# Altium schematic sheet satFloat.SchDoc
size Legal
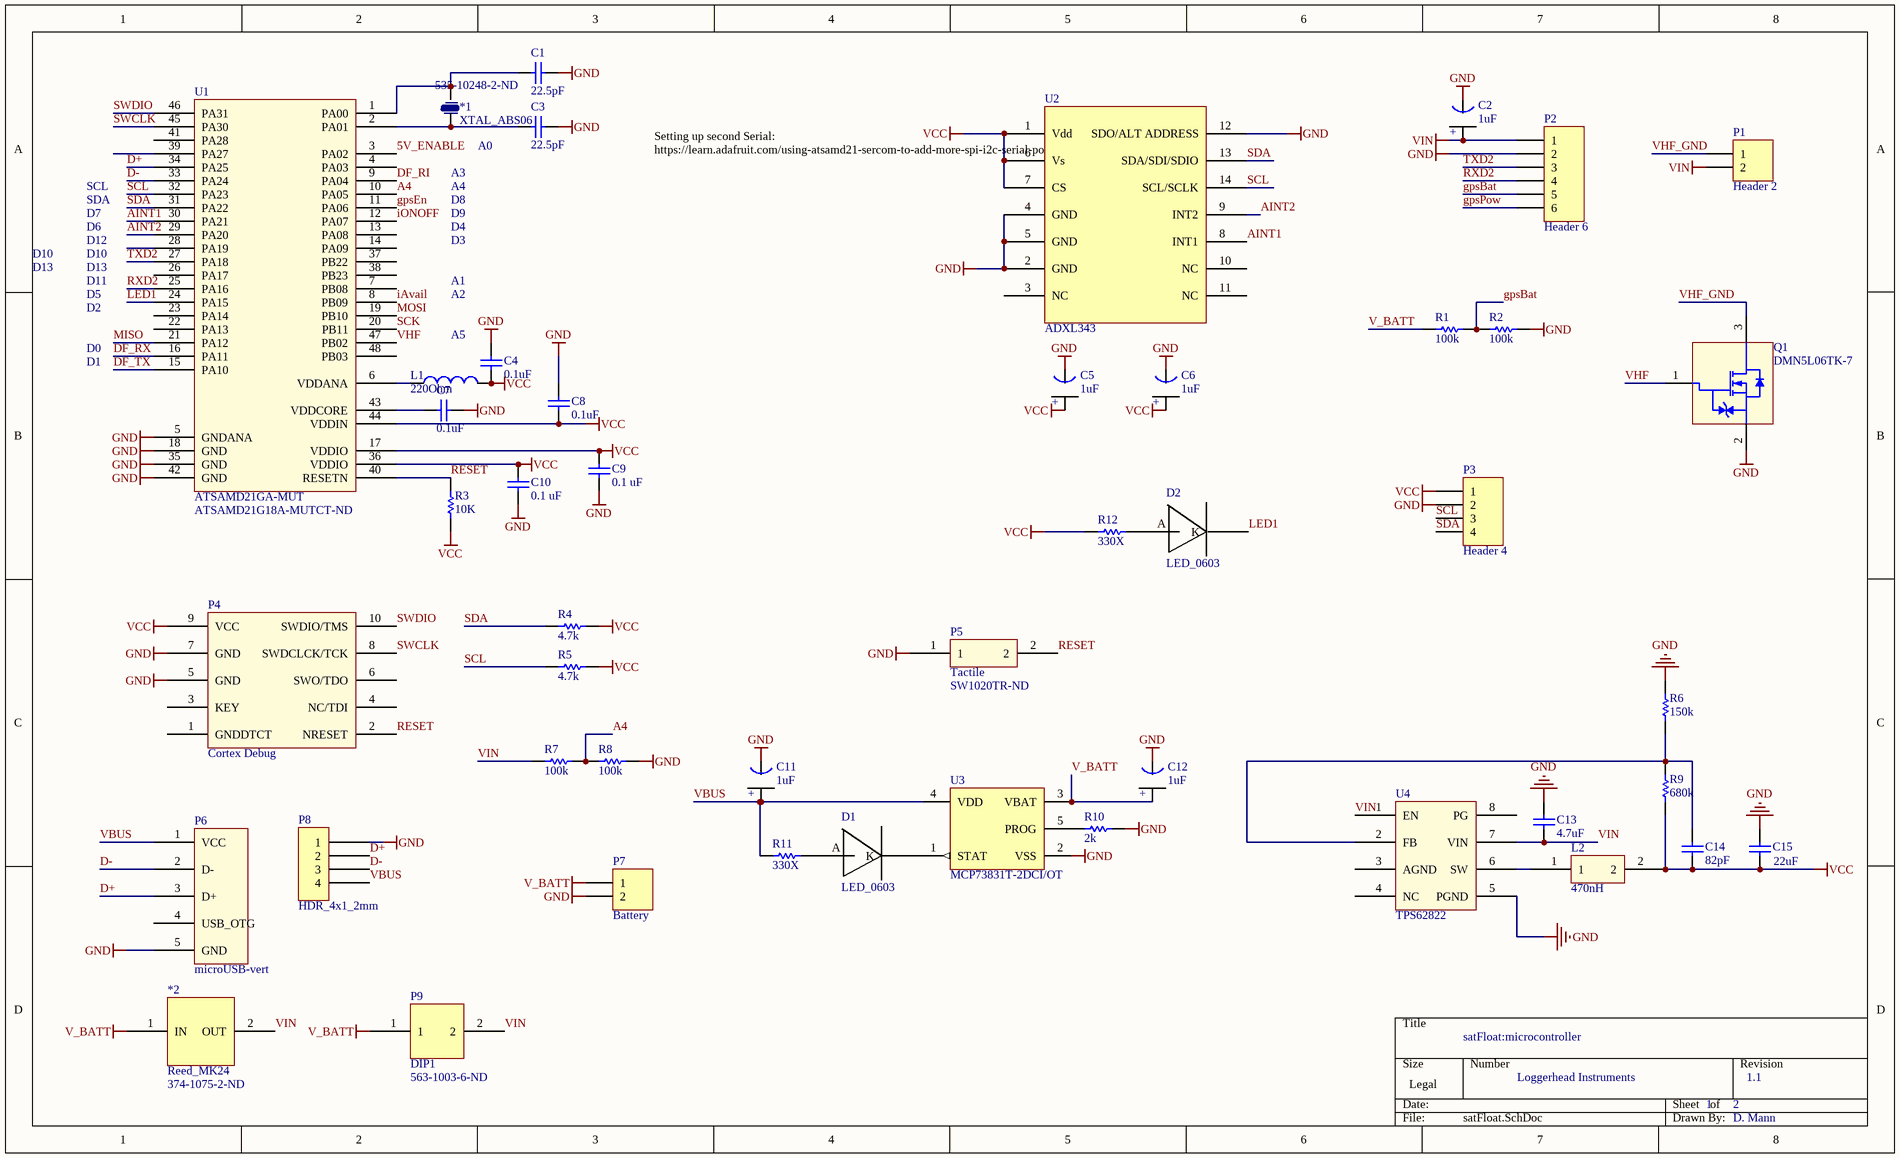
[diagram p0: satFloat.SchDoc]

## Parts
*1  XTAL_ABS06  Supplier Part Number 1: 535-10248-2-ND  [XTAL-ABS06]
*2  Reed_MK24  Supplier Part Number 1: 374-1075-2-ND  [Reed MK24-B-3]
C1  22.5pF  [0402]
C2  1uF  [Tant0805]
C3  22.5pF  [0402]
C4  0.1uF  [0402]
C5  1uF  [Tant0805]
C6  1uF  [Tant0805]
C7  0.1uF  [0402]
C8  0.1uF  [0402]
C9  0.1 uF  [0402]
C10  0.1 uF  [0402]
C11  1uF  [Tant0805]
C12  1uF  [Tant0805]
C13  4.7uF  [0603]
C14  82pF  [0402]
C15  22uF  [0603]
D1  LED_0603  [Diode0603]
D2  LED_0603  [Diode0603]
L1  220Ohm  [0805 (M2125) Ferrite]
L2  470nH  [Inductor_470NH]
P1  Header 2  [HDR1X2]
P2  Header 6  [HDR1X6]
P3  Header 4  [HDR1X4]
P4  Cortex Debug  [Header_2x5_50mil]
P5  Tactile  Supplier Part Number 1: SW1020TR-ND  [Tactile-B3U-1000]
P6  microUSB-vert  [MICROUSB-VERT]
P7  Battery  [HDR1X2]
P8  HDR_4x1_2mm  [Hdr_4x1_2mm]
P9  DIP1  Supplier Part Number 1: 563-1003-6-ND  [DIP1]
Q1  DMN5L06TK-7  [SOT-523]
R1  100k  [3-0603]
R2  100k  [3-0603]
R3  10K  [3-0603]
R4  4.7k  [3-0603]
R5  4.7k  [3-0603]
R6  150k  [3-0603]
R7  100k  [3-0603]
R8  100k  [3-0603]
R9  680k  [3-0603]
R10  2k  [3-0603]
R11  330X  [3-0603]
R12  330X  [3-0603]
U1  ATSAMD21GA-MUT  Supplier Part Number 1: ATSAMD21G18A-MUTCT-ND  [QFN127P600-8N]
U2  ADXL343  [ADXL345]
U3  MCP73831T-2DCI/OT  [SOT-23-OT5_N]
U4  TPS62822  [TPS62822_SOP8]

## Nets
GND: C1.1 C2.1(GND) C3.1 C4.2 C5.1(GND) C6.1(GND) C7.2 C8.2 C9.2 C10.2 C11.1(GND) C12.1(GND) C13.1 C15.1 P2.2 P3.2 P4.5(GND) P4.7(GND) P5.1 P6.5(GND) P7.2 P8.1 Q1.2(S) R2.1 R6.2 R8.1 R10.1 U1.5(GNDANA) U1.18(GND) U1.35(GND) U1.42(GND) U2.2(GND) U2.4(GND) U2.5(GND) U2.12(SDO/ALT_ADDRESS) U3.2(VSS) U4.5(PGND)
V_BATT: *2.1(IN) C12.2(+) P7.1 P9.1 R1.2 U3.3(VBAT)
VCC: C4.1 C5.2(+) C6.2(+) C8.1 C9.1 C10.1 C14.1 C15.2 L1.2 L2.2 P3.1 P4.9(VCC) R3.1 R4.1 R5.2 R9.1 R12.1 U1.17(VDDIO) U1.36(VDDIO) U1.44(VDDIN) U2.1(Vdd) U2.6(Vs) U2.7(CS)
VIN: *2.2(OUT) C2.2(+) C13.2 P1.2 P2.1 P9.2 R7.2 U4.1(EN) U4.7(VIN)
5V_ENABLE: U1.3(PA02)
A4: R7.1 R8.2 U1.10(PA05)
AINT1: U1.30(PA21) U2.8(INT1)
AINT2: U1.29(PA20) U2.9(INT2)
D+: P6.3(D+) P8.2 U1.34(PA25)
D-: P6.2(D-) P8.3 U1.33(PA24)
DF_RI: U1.9(PA04)
DF_RX: U1.16(PA11)
DF_TX: U1.15(PA10)
gpsBat: P2.5 R1.1 R2.2
gpsEn: U1.11(PA06)
gpsPow: P2.6
iAvail: U1.8(PB09)
iONOFF: U1.12(PA07)
LED1: D2.K U1.24(PA15)
MISO: U1.21(PA12)
MOSI: U1.19(PB10)
RESET: P4.2(NRESET) P5.2 R3.2 U1.40(RESETN)
RXD2: P2.4 U1.25(PA16)
SCK: U1.20(PB11)
SCL: P3.3 R5.1 U1.32(PA23) U2.14(SCL/SCLK)
SDA: P3.4 R4.2 U1.31(PA22) U2.13(SDA/SDI/SDIO)
SWCLK: P4.8(SWDCLCK/TCK) U1.45(PA30)
SWDIO: P4.10(SWDIO/TMS) U1.46(PA31)
TXD2: P2.3 U1.27(PA18)
VBUS: C11.2(+) P6.1(VCC) P8.4 R11.1 U3.4(VDD)
VHF: Q1.1(G) U1.47(PB02)
VHF_GND: P1.1 Q1.3(D)
Net*1_1: *1.1 C3.2 U1.2(PA01)
Net*1_2: *1.2 C1.2 U1.1(PA00)
NetC7_1: C7.1 U1.43(VDDCORE)
NetC14_2: C14.2 R6.1 R9.2 U4.2(FB)
NetD1_A: D1.A R11.2
NetD1_K: D1.K U3.1(STAT)
NetD2_A: D2.A R12.2
NetL1_1: L1.1 U1.6(VDDANA)
NetL2_1: L2.1 U4.6(SW)
NetR10_2: R10.2 U3.5(PROG)

Not connected (* = marked no-connect by the designer): P4 1(GNDDTCT) 3(KEY) 4(NC/TDI) 6(SWO/TDO); P6 4(USB_OTG); U1 4(PA03) 7(PB08) 13(PA08) 14(PA09) 22(PA13) 23(PA14) 26(PA17) 28(PA19) 37(PB22) 38(PB23) 39(PA27) 41(PA28) 48(PB03); U2 3(NC) 10(NC) 11(NC); U4 3(AGND) 4(NC) 8(PG)

## Notes on the sheet
- A0
- D6
- D7
- SDA
- SCL
- D8
- D4
- D9
- A3
- A4
- D10
- D13
- D5
- D11
- D12
- D3
- A1
- A2
- Setting up second Serial: https://learn.adafruit.com/using-atsamd21-sercom-to-add-more-spi-i2c-serial-ports/creating-a-new-serial
- D0
- D1
- D2
- A5
- satFloat:microcontroller
- Loggerhead Instruments
- 1
- 2
- 1.1
- D. Mann

## Library data of the parts
C1 C3 = C0402: Ceramic Chip Capacitor - Standard; Note: Footprint corresponds to dimensions for bulk cassette packaging. This case size has tightened tolerances.; Value: 12.5; Published: 17-Jul-2002; LatestRevisionDate: 19-Mar-2004; LatestRevisionNote: Silkscreen size reduced.; DatasheetDocument: Mar-2001; PackageDocument: Mar-2001; PackageReference: 0402; Publisher: Altium Limited; Code_JEITA: 0402; Code_IPC: 1005 [0402]; ComponentLink1Description: Manufacturer Link; ComponentLink1URL: http://www.kemet.com/; ComponentLink2Description: Datasheet; ComponentLink2URL: http://www.kemet.com/kemet/web/homepage/kechome.nsf/vapubfilesname/F3102TA.pdf/$file/F3102TA.pdf
C2 C5 C6 C11 C12 = Tant0805
  C2 C5 C6: Value: 1uF
  C11 C12: Value: *
C4 C7 C8 = C0402: Ceramic Chip Capacitor - Standard; Note: Footprint corresponds to dimensions for bulk cassette packaging. This case size has tightened tolerances.; Published: 17-Jul-2002; LatestRevisionDate: 19-Mar-2004; LatestRevisionNote: Silkscreen size reduced.; DatasheetDocument: Mar-2001; PackageDocument: Mar-2001; PackageReference: 0402; Publisher: Altium Limited; Code_JEITA: 0402; Code_IPC: 1005 [0402]; ComponentLink1Description: Manufacturer Link; ComponentLink1URL: http://www.kemet.com/; ComponentLink2Description: Datasheet; ComponentLink2URL: http://www.kemet.com/kemet/web/homepage/kechome.nsf/vapubfilesname/F3102TA.pdf/$file/F3102TA.pdf; Value: 0.1uF
C9 C10 C14 = C0402: Ceramic Chip Capacitor - Standard; Note: Footprint corresponds to dimensions for bulk cassette packaging. This case size has tightened tolerances.; Value: 0.1uF; Published: 17-Jul-2002; LatestRevisionDate: 19-Mar-2004; LatestRevisionNote: Silkscreen size reduced.; DatasheetDocument: Mar-2001; PackageDocument: Mar-2001; PackageReference: 0402; Publisher: Altium Limited; Code_JEITA: 0402; Code_IPC: 1005 [0402]; ComponentLink1Description: Manufacturer Link; ComponentLink1URL: http://www.kemet.com/; ComponentLink2Description: Datasheet; ComponentLink2URL: http://www.kemet.com/kemet/web/homepage/kechome.nsf/vapubfilesname/F3102TA.pdf/$file/F3102TA.pdf
C13 = C0603: Ceramic Chip Capacitor - Standard; Note: Footprint corresponds to dimensions for bulk cassette packaging. This case size has tightened tolerances.; Published: 17-Jul-2002; LatestRevisionDate: 19-Mar-2004; LatestRevisionNote: Silkscreen size reduced.; DatasheetDocument: Mar-2001; PackageDocument: Mar-2001; PackageReference: 0603; Publisher: Altium Limited; Code_JEITA: 0603; Code_IPC: 1608 [0603]; ComponentLink1Description: Manufacturer Link; ComponentLink1URL: http://www.kemet.com/; ComponentLink2Description: Datasheet; ComponentLink2URL: http://www.kemet.com/kemet/web/homepage/kechome.nsf/vapubfilesname/F3102TA.pdf/$file/F3102TA.pdf; Value: 4.7uF
C15 = C0603: Ceramic Chip Capacitor - Standard; Note: Footprint corresponds to dimensions for bulk cassette packaging. This case size has tightened tolerances.; Value: 4.7uF; Published: 17-Jul-2002; LatestRevisionDate: 19-Mar-2004; LatestRevisionNote: Silkscreen size reduced.; DatasheetDocument: Mar-2001; PackageDocument: Mar-2001; PackageReference: 0603; Publisher: Altium Limited; Code_JEITA: 0603; Code_IPC: 1608 [0603]; ComponentLink1Description: Manufacturer Link; ComponentLink1URL: http://www.kemet.com/; ComponentLink2Description: Datasheet; ComponentLink2URL: http://www.kemet.com/kemet/web/homepage/kechome.nsf/vapubfilesname/F3102TA.pdf/$file/F3102TA.pdf
L1 = Ferrite 0805(M2125) 3A: Ferrite 25mOhm@DC,  60 Ohm@100MHz; Fabrication Tested: NO; Value: 300Ohm; Creator and Date: Design Engineer's Name; Footprint Verified By: *; Schematic Verified By: *; Vendor Info Verified By: *; HelpURL: http://www.yuden.co.jp/ut/product/pdf/mlci08_e.pdf; Mass (place origin at center): *; Supplier 1: Digi-Key; Supplier Part Number 1: 587-1932-1-ND; Supplier 2: Newark; Supplier Part Number 2: 73M9170
L2 = Inductor_470NH: Supplier 1: Newark; Supplier Part Number 1: 27T2304
P1 P7 = Header 2: Header, 2-Pin; LatestRevisionDate: 17-Jul-2002; LatestRevisionNote: Re-released for DXP Platform.; Publisher: Altium Limited
P2 = Header 6: Header, 6-Pin; LatestRevisionDate: 17-Jul-2002; LatestRevisionNote: Re-released for DXP Platform.; Publisher: Altium Limited
P3 = Header 4: Header, 4-Pin; LatestRevisionDate: 17-Jul-2002; LatestRevisionNote: Re-released for DXP Platform.; Publisher: Altium Limited
P4 = CortexDebug
P5 = Tactile_B3U-1000: Supplier 1: Digi-Key
P6 = microUSB-vert: Molex 105133-0011
Q1 = FET DMN5L06TK-7: Ultra-low leakage Enhanced MOSFET; Fabrication Tested: NO; Creator and Date: Will Flanery 2010-09-02; Footprint Verified By: *; Schematic Verified By: *; Vendor Info Verified By: *; Supplier 1: Digi-Key; Supplier Part Number 1: DMN5L06TKDICT-ND; HelpURL: http://www.diodes.com/datasheets/ds30926.pdf
R1-R12 = ERJ3RK: Precision Thick Film Chip Resistor, 10 Ohm to 1M Ohm Range, 1% and 0.5% Tolerance, 0603 Size, 0.063 W; Published: 17-Dec-2003; LatestRevisionDate: 19-Mar-2004; LatestRevisionNote: Silkscreen size reduced.; PackageDocument: Mar-2003; PackageReference: 3-0603; Publisher: Altium Limited; Code_IPC: 1608 [0603]; ComponentLink1Description: Manufacturer Link; ComponentLink1URL: http://www.panasonic.com/industrial/components/resistive_products.htm; ComponentLink2Description: Datasheet; ComponentLink2URL: http://www.panasonic.com/industrial/components/pdf/AOA0000CE2.pdf
U1 = ATSAMD21G18: Supplier 1: Digi-Key
U2 = ADXL345
U3 = MCP73831T-2DCI/OT: Miniature Single-Cell, Fully Integrated Li-Ion, Li-Polymer Charge Management Controller, 4.2V, 5-Pin SOT-23, Industrial Temperature, Tape and Reel; DatasheetVersion: revE, Sep-2008; PackageVersion: revBB, Aug-2009; PackageReference: SOT-23-OT5; PackageDescription: 5-Lead Plastic Small Outline Transistor (OT) [SOT-23]; Code_IPC: SOT23-5; ComponentLink1Description: Manufacturer URL; ComponentLink1URL: http://www.microchip.com/; ComponentLink2Description: Datasheet; ComponentLink2URL: http://ww1.microchip.com/downloads/en/DeviceDoc/21984e.pdf; ComponentLink3Description: Package Specification; ComponentLink3URL: http://www.microchip.com/stellent/groups/techpub_sg/documents/packagingspec/en012702.pdf
U4 = TPS62822: Step-down converter; Supplier 1: Farnell; Supplier Part Number 1: 2894176
*1 = XTAL_ABS06: Supplier 1: Digi-Key
*2 = Reed_MK24: Supplier 1: Digi-Key
P9 = DIP1: Supplier 1: Digi-Key